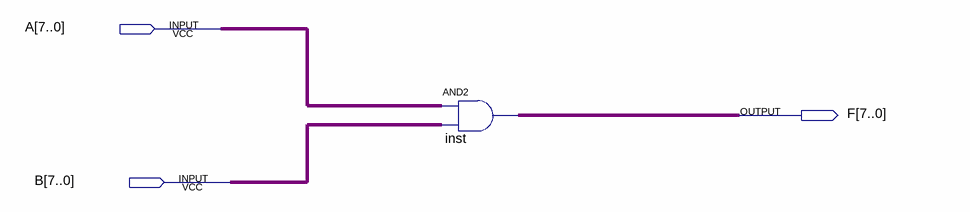
[diagram p0: schematic sheet]
// Quartus schematic D.bdf as structural Verilog: 1 symbols, 3 pins
module D (
  input  [7:0] A,
  input  [7:0] B,
  output [7:0] F
);

  assign F = A & B;  // AND2 inst, 8 bits wide
endmodule
